# EAGLE schematic SNES_AddOn1Chip_SMD (EAGLE 7.0.0)
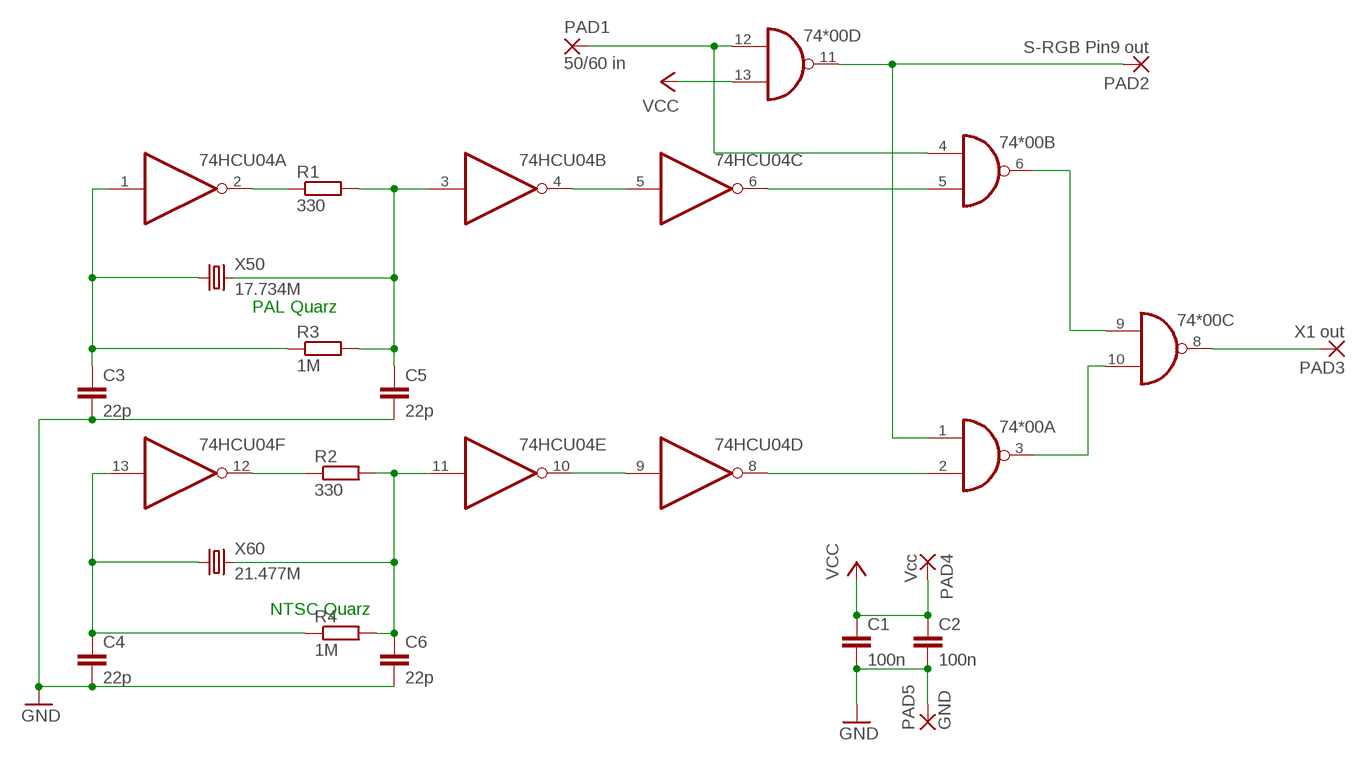
[diagram p0: schematic, sheet 1]

## Parts
74*00  7400D  [SO14]
74HCU04  74HC04D  [SO14]
C1  100n  C0805  [Z0805]
C2  100n  C0805  [Z0805]
C3  22p  C0805  [Z0805]
C4  22p  C0805  [Z0805]
C5  22p  C0805  [Z0805]
C6  22p  C0805  [Z0805]
PAD1  50/60 in  SMD2  [SMD1,27-2,54]
PAD2  S-RGB Pin9 out  SMD2  [SMD1,27-2,54]
PAD3  X1 out  SMD2  [SMD1,27-2,54]
PAD4  Vcc  SMD5  [SMD2,54-5,08]
PAD5  GND  SMD5  [SMD2,54-5,08]
R1  330  R0805  [Z0805]
R2  330  R0805  [Z0805]
R3  1M  R0805  [Z0805]
R4  1M  R0805  [Z0805]
X50  17.734M  MY_CRYSTALS  [MY_SMD_CRYSTAL2]
X60  21.477M  MY_CRYSTALS  [MY_SMD_CRYSTAL2]

## Nets
GND: C1.2 C2.2 C3.2 C4.2 C5.2 C6.2 PAD5.1(P)
N$27: 74HCU04.1(A:I) C3.1 R3.1 X50.1
N$28: 74HCU04.3(B:I) C5.1 R1.2 R3.2 X50.2
N$29: 74HCU04.13(F:I) C4.1 R4.1 X60.1
N$30: 74HCU04.11(E:I) C6.1 R2.2 R4.2 X60.2
N$31: 74*00.3(A:O) 74*00.10(C:I1)
N$32: 74*00.6(B:O) 74*00.9(C:I0)
N$33: 74*00.4(B:I0) 74*00.12(D:I0) PAD1.1(P)
N$35: 74*00.1(A:I0) 74*00.11(D:O) PAD2.1(P)
N$36: 74*00.8(C:O) PAD3.1(P)
N$37: 74HCU04.2(A:O) R1.1
N$38: 74HCU04.4(B:O) 74HCU04.5(C:I)
N$39: 74*00.5(B:I1) 74HCU04.6(C:O)
N$41: 74*00.2(A:I1) 74HCU04.8(D:O)
N$44: 74HCU04.9(D:I) 74HCU04.10(E:O)
N$50: 74HCU04.12(F:O) R2.1
VCC: 74*00.13(D:I1) C1.1 C2.1 PAD4.1(P)

## Notes on the sheet
- PAL Quarz
- NTSC Quarz

## Power pins joined to a net without a drawn wire
GND: 74*00.7(P:GND) 74HCU04.7(P:GND)
VCC: 74*00.14(P:VCC) 74HCU04.14(P:VCC)

## Library data of the parts
74*00 = 74xx-eu:74*00: Quad 2-input NAND gate
74HCU04 = 74xx-eu:74*04: Hex INVERTER
C1-C6 = snescart:C0805
PAD1-PAD3 = wirepad:SMD2: SMD PAD
PAD4 PAD5 = wirepad:SMD5: SMD PAD
R1-R4 = snescart:R0805
X50 X60 = snes_div:MY_CRYSTALS